# EAGLE design chariotgauge (EAGLE 6.2)
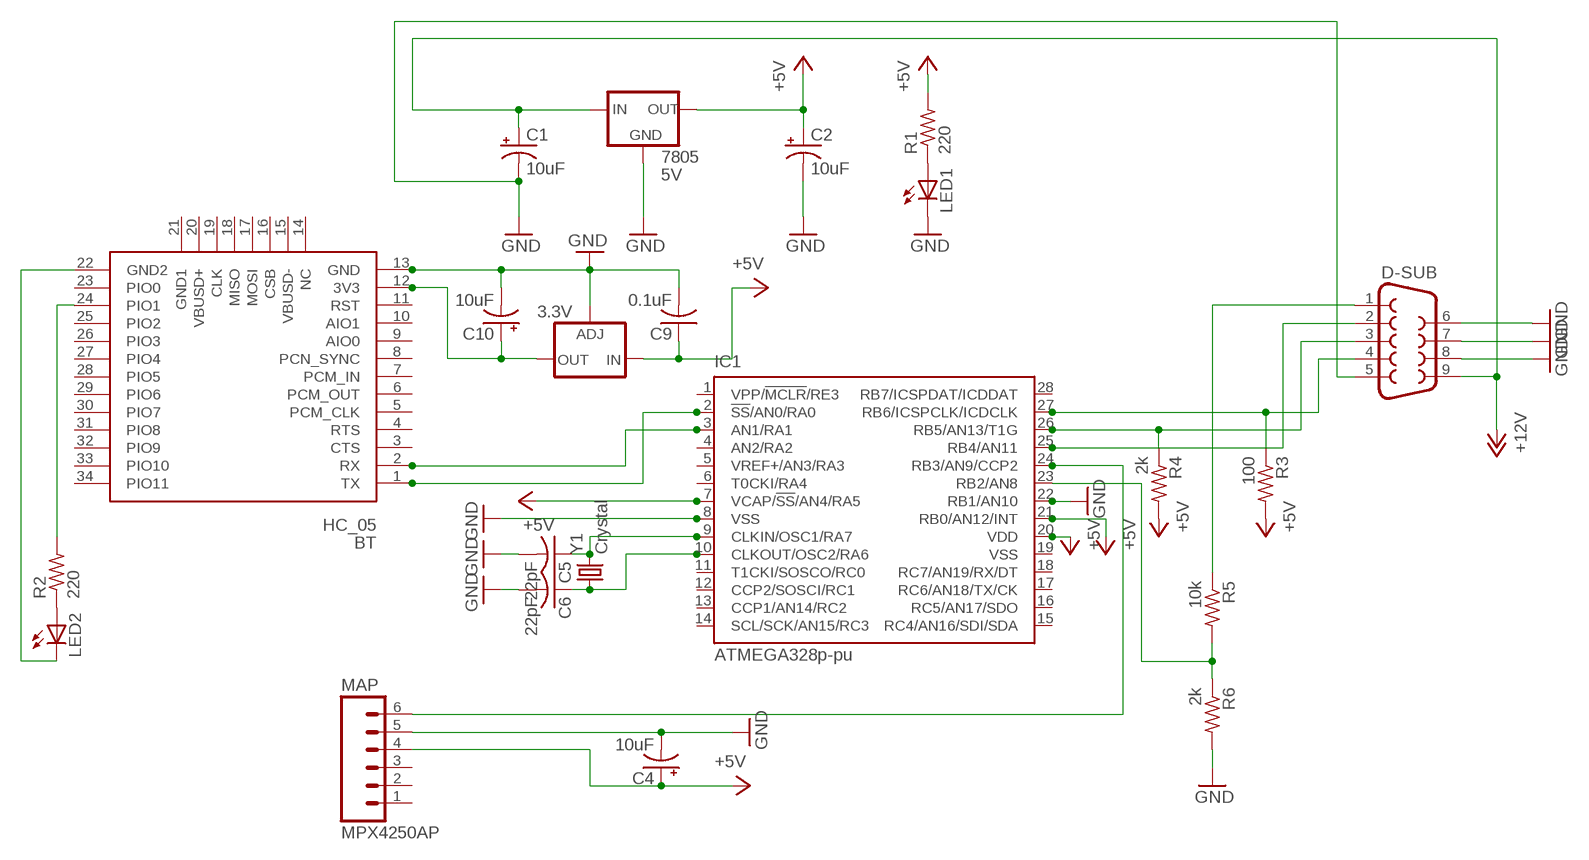
[diagram p0: schematic, sheet 1]

## Parts
3.3V  LM317TL  [317TL]
7805  5V  78XXL  [78XXL]
BT  HC_05  [BLUETOOTH_SMD]
C1  10uF  CAP_POLPTH2  [CPOL-RADIAL-10UF-25V]
C2  10uF  CAP_POLPTH2  [CPOL-RADIAL-10UF-25V]
C4  10uF  CAP_POLPTH2  [CPOL-RADIAL-10UF-25V]
C5  22pF  C-US025-025X050  [C025-025X050]
C6  22pF  C-US025-025X050  [C025-025X050]
C9  0.1uF  C-US025-025X050  [C025-025X050]
C10  10uF  CAP_POLPTH2  [CPOL-RADIAL-10UF-25V]
D-SUB  DB9FEMALE  [DB9]
IC1  ATMEGA328p-pu  PIC16F1516/18P  [DIL28-3]
LED1  LED5MM  [LED5MM]
LED2  LED5MM  [LED5MM]
MAP  MPX4250AP  M06LONGPADS  [1X06_LONGPADS]
R1  220  R-US_0204/7  [0204/7]
R2  220  R-US_0204/7  [0204/7]
R3  100  R-US_0204/7  [0204/7]
R4  2k  R-US_0204/7  [0204/7]
R5  10k  R-US_0204/7  [0204/7]
R6  2k  R-US_0204/7  [0204/7]
Y1  Crystal  CRYSTALHC49US  [HC49US]

## Nets
+5V: 3.3V.3(IN) 7805.OUT C2.1(+) C4.1(+) C9.1 IC1.7(VCAP/!SS!/AN4/RA5) IC1.20(VDD) IC1.21(RB0/AN12/INT) MAP.4 R1.2 R3.2 R4.2
+12V: 7805.IN C1.1(+) D-SUB.9
GND: 3.3V.1(ADJ) 7805.GND BT.13(GND) C1.2(-) C2.2(-) C4.2(-) C5.2 C6.2 C9.2 C10.2(-) D-SUB.5 D-SUB.6 D-SUB.7 D-SUB.8 IC1.8(VSS) IC1.22(RB1/AN10) LED1.K(C) MAP.5 R6.2
N$2: LED1.A R1.1
N$3: IC1.24(RB3/AN9/CCP2) MAP.6
N$4: D-SUB.2 IC1.25(RB4/AN11)
N$5: BT.1(TX) IC1.2(!SS!/AN0/RA0)
N$6: D-SUB.3 IC1.26(RB5/AN13/T1G) R4.1
N$7: BT.24(PIO1) R2.2
N$8: D-SUB.4 IC1.27(RB6/ICSPCLK/ICDCLK) R3.1
N$9: BT.2(RX) IC1.3(AN1/RA1)
N$10: C5.1 IC1.9(CLKIN/OSC1/RA7) Y1.2
N$11: C6.1 IC1.10(CLKOUT/OSC2/RA6) Y1.1
N$13: LED2.A R2.1
N$14: 3.3V.2(OUT) BT.12(3V3) C10.1(+)
N$15: D-SUB.1 R5.1
N$16: BT.22(GND2) LED2.K(C)
N$18: IC1.23(RB2/AN8) R5.2 R6.1
Unconnected: BT.3(CTS) BT.4(RTS) BT.5(PCM_CLK) BT.6(PCM_OUT) BT.7(PCM_IN) BT.8(PCN_SYNC) BT.9(AIO0) BT.10(AIO1) BT.11(RST) BT.14(NC) BT.15(VBUSD-) BT.16(CSB) BT.17(MOSI) BT.18(MISO) BT.19(CLK) BT.20(VBUSD+) BT.21(GND1) BT.23(PIO0) BT.25(PIO2) BT.26(PIO3) BT.27(PIO4) BT.28(PIO5) BT.29(PIO6) BT.30(PIO7) BT.31(PIO8) BT.32(PIO9) BT.33(PIO10) BT.34(PIO11) IC1.1(VPP/!MCLR!/RE3) IC1.4(AN2/RA2) IC1.5(VREF+/AN3/RA3) IC1.6(T0CKI/RA4) IC1.11(T1CKI/SOSCO/RC0) IC1.12(CCP2/SOSCI/RC1) IC1.13(CCP1/AN14/RC2) IC1.14(SCL/SCK/AN15/RC3) IC1.15(RC4/AN16/SDI/SDA) IC1.16(RC5/AN17/SDO) IC1.17(RC6/AN18/TX/CK) IC1.18(RC7/AN19/RX/DT) IC1.28(RB7/ICSPDAT/ICDDAT) MAP.1 MAP.2 MAP.3

## Power pins joined to a net without a drawn wire
VSS: IC1.19(VSS)

## Library data of the parts
3.3V = v-reg:LM317TL: VOLTAGE REGULATOR
7805 = v-reg:78XXL: VOLTAGE REGULATOR
BT = SerialPortBluetooth:HC_05
C1 C2 C4 C10 = SparkFun-Passives:CAP_POL: Capacitor Polarized These are standard SMD and PTH capacitors. Normally 10uF, 47uF, and 100uF in electrolytic and tantalum varieties. Always verify the external diameter of the through hole cap, it varies with capacity, voltage, and manufacturer. The EIA devices should be standard.
C5 C6 C9 = rcl:C-US: CAPACITOR, American symbol
D-SUB = SparkFun-Connectors:DB9: DB9 Connector Standard DB9 (D-Sub 9) serial connector. Can be used for CAN bus as well as RS485 and RS232. Footprint production proven. Spark Fun Electronics SKU : PRT-00429
IC1 = microchip:PIC16*F1516/18: 28/40/44-Pin Flash Microcontrollers with nanoWatt XLP Technology PIC16F1516/1518 AND PIC16LF1516/1518 Source: www.microchip.com PIC16F1516.pdf
LED1 LED2 = led:LED: LED OSRAM: - CHIPLED LG R971, LG N971, LY N971, LG Q971, LY Q971, LO R971, LY R971 LH N974, LH R974 LS Q976, LO Q976, LY Q976 LO Q996 - Hyper CHIPLED LW Q18S LB Q993, LB Q99A, LB R99A - SideLED LS A670, LO A670, LY A670, LG A670, LP A670 LB A673, LV A673, LT A673, LW A673 LH A674 LY A675 LS A676, LA A676, LO A676, LY A676, LW A676 LS A679, LY A679, LG A679 - Hyper Micro SIDELED® LS Y876, LA Y876, LO Y876, LY Y876 LT Y87S - SmartLED LW L88C, LW L88S LB L89C, LB L89S, LG L890 LS L89K, LO L89K, LY L89K LS L896, LA L896, LO L896, LY L896 - TOPLED LS T670, LO T670, LY T670, LG T670, LP T670 LSG T670, LSP T670, LSY T670, LOP T670, LYG T670 LG T671, LOG T671, LSG T671 LB T673, LV T673, LT T673, LW T673 LH T674 LS T676, LA T676, LO T676, LY T676, LB T676, LH T676, LSB T676, LW T676 LB T67C, LV T67C, LT T67C, LS T67K, LO T67K, LY T67K, LW E67C LS E67B, LA E67B, LO E67B, LY E67B, LB E67C, LV E67C, LT E67C LW T67C LS T679, LY T679, LG T679 LS T770, LO T770, LY T770, LG T770, LP T770 LB T773, LV T773, LT T773, LW T773 LH T774 LS E675, LA E675, LY E675, LS T675 LS T776, LA T776, LO T776, LY T776, LB T776 LHGB T686 LT T68C, LB T68C - Hyper Mini TOPLED® LB M676 - Mini TOPLED Santana® LG M470 LS M47K, LO M47K, LY M47K Source: http://www.osram.convergy.de LUXEON: - LUMILED® LXK2-PW12-R00, LXK2-PW12-S00, LXK2-PW14-U00, LXK2-PW14-V00 LXK2-PM12-R00, LXK2-PM12-S00, LXK2-PM14-U00 LXK2-PE12-Q00, LXK2-PE12-R00, LXK2-PE12-S00, LXK2-PE14-T00, LXK2-PE14-U00 LXK2-PB12-K00, LXK2-PB12-L00, LXK2-PB12-M00, LXK2-PB14-N00, LXK2-PB14-P00, LXK2-PB14-Q00 LXK2-PR12-L00, LXK2-PR12-M00, LXK2-PR14-Q00, LXK2-PR14-R00 LXK2-PD12-Q00, LXK2-PD12-R00, LXK2-PD12-S00 LXK2-PH12-R00, LXK2-PH12-S00 LXK2-PL12-P00, LXK2-PL12-Q00, LXK2-PL12-R00 Source: www.luxeon.com KINGBRIGHT: KA-3528ASYC Source: www.kingbright.com
MAP = SparkFun-Connectors:M06: Header 6 Standard 6-pin 0.1" header. Use with straight break away headers (SKU : PRT-00116), right angle break away headers (PRT-00553), swiss pins (PRT-00743), machine pins (PRT-00117), and female headers (PRT-00115). Molex polarized connector foot print use with SKU : PRT-08094 with associated crimp pins and housings. NOTES ON THE VARIANTS LOCK and LOCK_LONGPADS... This footprint was designed to help hold the alignment of a through-hole component (i.e. 6-pin header) while soldering it into place. You may notice that each hole has been shifted either up or down by 0.005 of an inch from it's more standard position (which is a perfectly straight line). This slight alteration caused the pins (the squares in the middle) to touch the edges of the holes. Because they are alternating, it causes a "brace" to hold the component in place. 0.005 has proven to be the perfect amount of "off-center" position when using our standard breakaway headers. Although looks a little odd when you look at the bare footprint, once you have a header in there, the alteration is very hard to notice. Also, if you push a header all the way into place, it is covered up entirely on the bottom side. This idea of altering the position of holes to aid alignment will be further integrated into the Sparkfun Library for other footprints. It can help hold any component with 3 or more connection pins.
R1-R6 = rcl:R-US_: RESISTOR, American symbol
Y1 = SparkFun-FreqCtrl:CRYSTAL: Various standard crystals. Proven footprints. Spark Fun Electronics SKU : COM-00534

## Board
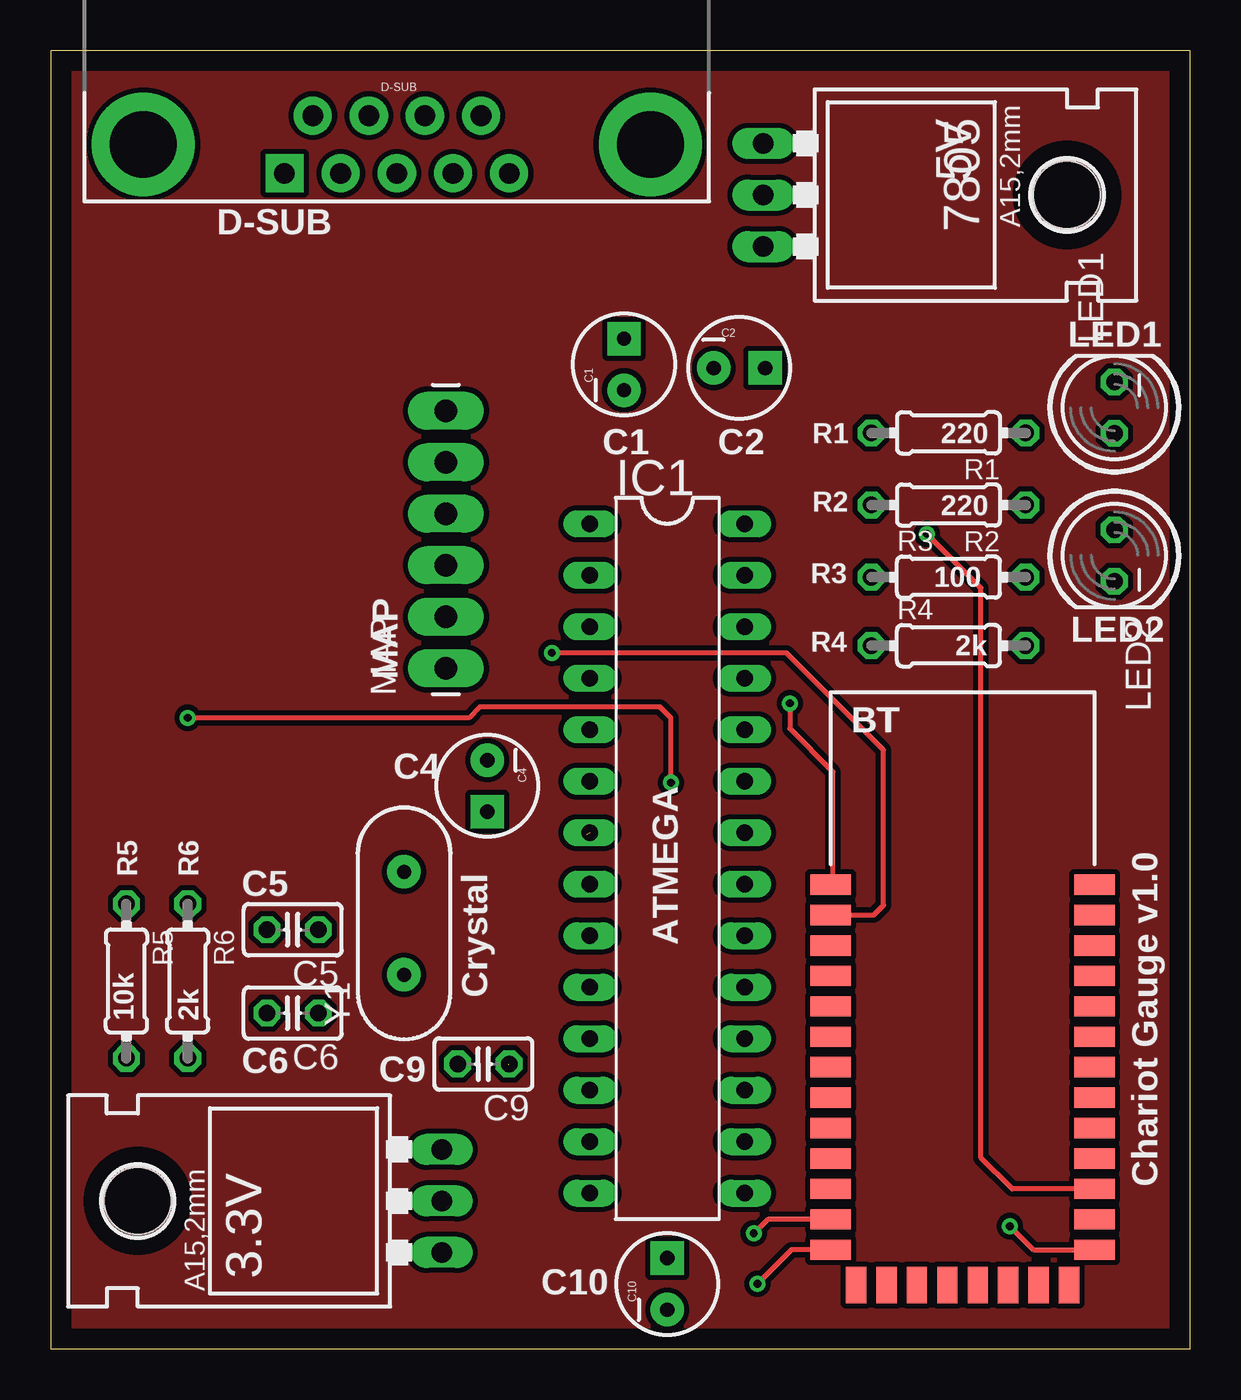
[diagram p1: board, top side]
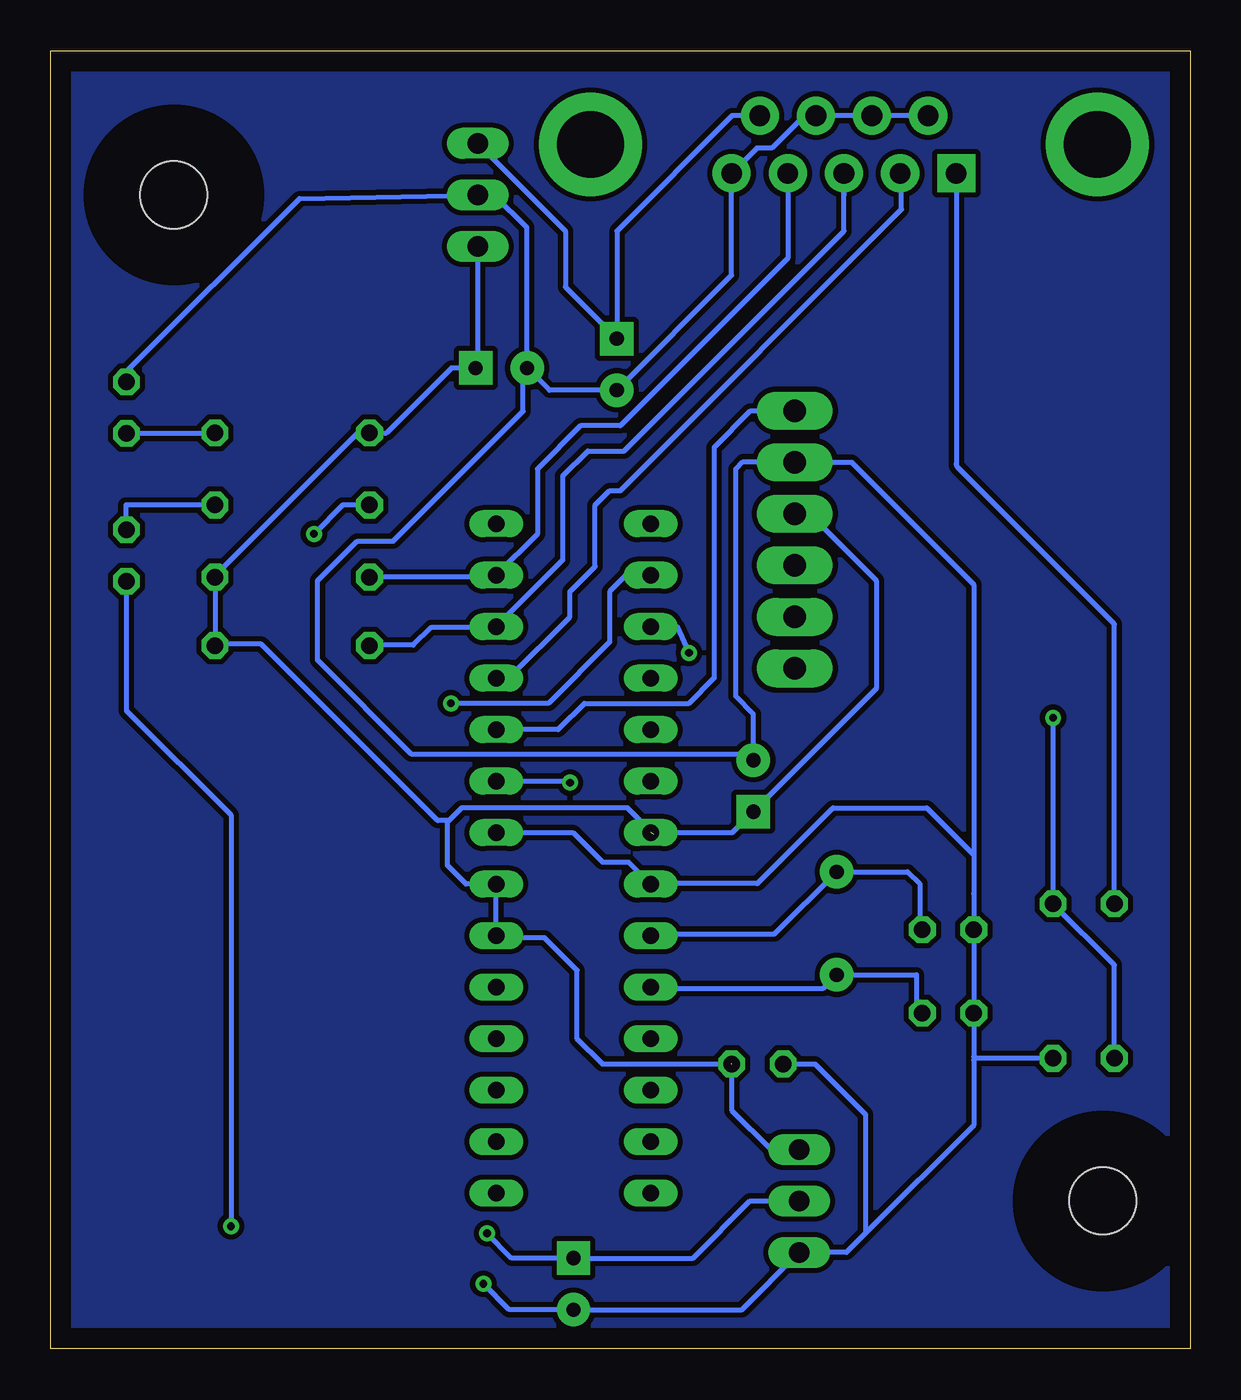
[diagram p2: board, bottom side, seen from below]

Size 56.18 x 64.01 mm. Coordinates in mm from the lower left corner, seen from the top.
Outline: 0,0 56.19,0 56.19,64.01 0,64.01 0,0
Copper layers (1*16): Top 0.035mm / dielectric 1.5mm / Bottom 0.035mm
Design rules: minimum track width 10mil, minimum drill 24mil, track to track 8mil, track to pad 8mil, pad to pad 8mil, via to via 8mil, smd to smd 8mil, copper to edge 40mil, drill to drill 8mil, minimum pad ring 10mil, minimum via ring 8mil, stop-mask expansion 4mil, vias tented up to drill 0mil, thermal gap 10mil

### Footprints (pad centres in the part's own frame; a part is rotated, then mirrored left to right if it is on the bottom)
317TL = drill 1.016 long: 1 -2.54,-3.81; 2 0,-3.81; 3 2.54,-3.81 | hole 3.302: 0,11.176
78XXL = drill 1.016 long: GND 0,-3.81; IN -2.54,-3.81; OUT 2.54,-3.81 | hole 3.302: 0,11.176
BLUETOOTH_SMD = smd 2 x 1: 1 0,0; 2 0,-1.5; 3 0,-3; 4 0,-4.5; 5 0,-6; 6 0,-7.5; 7 0,-9; 8 0,-10.5; 9 0,-12; 10 0,-13.5; 11 0,-15; 12 0,-16.5; 13 0,-18; 22 13,-18; 23 13,-16.5; 24 13,-15; 25 13,-13.5; 26 13,-12; 27 13,-10.5; 28 13,-9; 29 13,-7.5; 30 13,-6; 31 13,-4.5; 32 13,-3; 33 13,-1.5; 34 13,0 | smd 1 x 1.8: 14 1.25,-19.75; 15 2.75,-19.75; 16 4.25,-19.75; 17 5.75,-19.75; 18 7.25,-19.75; 19 8.75,-19.75; 20 10.25,-19.75; 21 11.75,-19.75
CPOL-RADIAL-10UF-25V = drill 0.7 pad 1.651 square: 1 1.27,0 | drill 0.7 pad 1.651: 2 -1.27,0
C025-025X050 = drill 0.813 octagon: 1 -1.27,0; 2 1.27,0
DB9 = drill 1.016 pad 1.88 square: 1 -5.54,-1.42 | drill 1.016 pad 1.88: 2 -2.77,-1.42; 3 0,-1.42; 4 2.77,-1.42; 5 5.54,-1.42; 6 -4.15,1.42; 7 -1.38,1.42; 8 1.38,1.42; 9 4.15,1.42 | drill 3.302 pad 5.08: G1 -12.5,0; G2 12.5,0
DIL28-3 = drill 0.813 long: 1 -16.51,-3.81; 2 -13.97,-3.81; 3 -11.43,-3.81; 4 -8.89,-3.81; 5 -6.35,-3.81; 6 -3.81,-3.81; 7 -1.27,-3.81; 8 1.27,-3.81; 9 3.81,-3.81; 10 6.35,-3.81; 11 8.89,-3.81; 12 11.43,-3.81; 13 13.97,-3.81; 14 16.51,-3.81; 15 16.51,3.81; 16 13.97,3.81; 17 11.43,3.81; 18 8.89,3.81; 19 6.35,3.81; 20 3.81,3.81; 21 1.27,3.81; 22 -1.27,3.81; 23 -3.81,3.81; 24 -6.35,3.81; 25 -8.89,3.81; 26 -11.43,3.81; 27 -13.97,3.81; 28 -16.51,3.81
LED5MM = drill 0.813 octagon: A -1.27,0; K 1.27,0
1X06_LONGPADS = drill 1.118 pad 1.88 long: 1 0,0; 2 2.54,0; 3 5.08,0; 4 7.62,0; 5 10.16,0; 6 12.7,0
0204/7 = drill 0.813 octagon: 1 -3.81,0; 2 3.81,0
HC49US = drill 0.7 pad 1.651: 1 -2.54,0; 2 2.54,0

### Placement (x,y rotation side)
3.3V  15.47,7.29 90 top
7805  38.94,56.9 270 top
BT  38.46,22.88 0 top
C1  28.27,48.54 90 top
C2  33.96,48.36 0 top
C4  21.53,27.75 270 top
C5  11.93,20.67 180 top
C6  11.93,16.55 180 top
C9  21.34,14.05 180 top
C10  30.4,3.2 90 top
D-SUB  17.07,59.39 0 top
IC1  30.4,24.18 270 top
LED1  52.45,46.41 90 top
LED2  52.45,39.12 270 top
MAP  19.49,33.55 90 top
R1  44.27,45.16 180 top
R2  44.27,41.61 180 top
R3  44.27,38.05 0 top
R4  44.27,34.67 0 top
R5  3.73,18.14 270 top
R6  6.76,18.14 270 top
Y1  17.42,20.98 90 top

### Tracks (layer width: path | path; a pad name or v marks a point on that pad's centre or on a via)
+5V  (2 unrouted)
  Bottom 0.254: 26.43,25.36 27.74,26.67 35.92,26.67 36.54,26.05 | 36.54,26.05 36.63,25.96 36.63,23.82 35.71,22.91 IC1.21 IC1.20 34.11,20.27 31.83,20.27 30.23,18.67 30.23,15.29 28.98,14.05 C9.1 | 36.54,26.05 37.1,26.05 45.8,34.75 48.12,34.75 R4.2 R3.2 48.18,38.03 41.05,45.16 R1.2 39.62,45.16 36.42,48.36 C2.1 35.13,48.46 7805.OUT | 3.3V.3 20.68,9.83 22.58,11.73 22.58,14.02 | IC1.7 22.57,25.45 C4.1 15.47,32.55 15.47,37.87 18.77,41.17 MAP.4
+12V
  Bottom 0.254: D-SUB.9 22.58,60.8 28.27,55.12 C1.1 30.81,52.35 30.81,55.12 7805.IN
GND  (via drill 0.38)
  Top 0.254: BT.13 36.53,4.88 v34.85,3.2
  Bottom 0.152: 10.64,14.25 10.66,14.22
  Bottom 0.254: 26.64,22.91 IC1.8 | IC1.22 30.43,25.45 28.98,24 27.69,24 IC1.8 | IC1.8 26.57,22.94 21.34,22.94 17.6,26.67 12.98,26.67 10.67,24.36 | D-SUB.6 D-SUB.7 D-SUB.8 19.03,60.8 20.62,59.21 21.37,59.21 D-SUB.5 22.61,52.93 C1.2 31.6,47.27 C2.2 | 52.48,47.65 LED1.K 52.45,48.18 43.92,56.72 7805.GND 34.31,56.9 32.72,55.3 32.72,48.39 C2.2 | 10.67,24.36 10.67,22.45 C5.2 C6.2 10.66,14.4 | 10.66,14.4 10.66,14.22 10.66,11.03 16,5.69 | C2.2 32.89,48.16 32.89,46.23 39.29,39.83 41.07,39.83 43.03,37.87 43.03,33.96 38.41,29.34 21.85,29.34 C4.2 21.53,31.31 22.4,32.18 22.4,43.38 22.05,43.74 19.51,43.74 MAP.5 16.69,43.72 10.67,37.69 10.67,24.36 | v34.85,3.2 33.58,1.93 C10.2 22.1,1.93 3.3V.1 16.94,4.75 16,5.69 | 16,5.69 16,11.56 18.49,14.05 C9.2 | 10.66,14.4 10.66,14.4 arc-45 10.48,14.33 R6.2
N$1
  pour Bottom (isolate 0.254): 0,64.01 56.18,64.01 56.18,0 0,0
N$2
  Bottom 0.254: R1.1 48.25,45.12 LED1.A
N$3
  Bottom 0.254: IC1.24 31.17,30.53 29.87,31.83 24.71,31.83 23.47,33.07 23.47,44.45 21.69,46.23 19.52,46.23 MAP.6
N$4
  Bottom 0.254: 14.4,57.97 D-SUB.2 14.22,57.89 14.22,56.19 28.09,42.32 28.63,42.32 29.34,41.6 29.34,38.58 30.58,37.34 30.58,36.09 33.6,33.07 IC1.25
N$5  (via drill 0.38)
  Top 0.254: BT.1 38.58,23 38.58,28.45 36.45,30.58 v36.45,31.83
  Bottom 0.254: IC1.2 27.81,38.15 28.63,37.34 28.63,34.85 31.65,31.83 v36.45,31.83
N$6
  Bottom 0.254: R4.1 40.45,34.7 38.3,34.7 37.44,35.56 34.26,35.56 IC1.26 30.94,38.89 30.94,43.03 29.69,44.27 27.91,44.27 17.07,55.12 D-SUB.3 17.07,56.9
N$7  (via drill 0.38)
  Top 0.254: BT.24 47.41,7.88 45.87,9.42 45.87,37.52 v43.2,40.18
  Bottom 0.254: R2.2 41.78,41.6 v43.2,40.18
N$8
  Bottom 0.254: R3.1 34.31,38.05 IC1.27 32.18,40.18 32.18,43.38 30.05,45.52 28.09,45.52 19.84,53.77 D-SUB.4
N$9  (via drill 0.38)
  Top 0.254: BT.2 40.59,21.39 41.07,21.87 41.07,29.52 36.27,34.31 v24.71,34.31
  Bottom 0.254: IC1.3 25.3,35.61 v24.71,34.31
N$10
  Bottom 0.254: IC1.9 26.52,20.45 20.5,20.45 Y1.2 13.92,23.52 13.34,22.94 13.34,20.8 C5.1
N$11
  Bottom 0.254: IC1.10 26.54,17.78 18.09,17.78 Y1.1 13.49,18.44 13.49,16.84 C6.1
N$12
  pour Top (isolate 0.254): 0,64.01 56.18,64.01 56.18,0 0,0
N$13
  Bottom 0.254: R2.1 52.48,41.6 LED2.A
N$14  (via drill 0.38)
  Top 0.254: BT.12 35.37,6.38 v34.67,5.69
  Bottom 0.254: 3.3V.2 21.69,7.29 24.51,4.47 C10.1 33.45,4.47 v34.67,5.69
N$15
  Bottom 0.254: D-SUB.1 11.53,43.64 arc-45 11.45,43.46 3.73,35.74 R5.1
N$16  (via drill 0.38)
  Top 0.254: v47.3,6.04 48.45,4.88 BT.22
  Bottom 0.254: LED2.K 52.45,31.47 47.3,26.31 v47.3,6.04
N$18  (via drill 0.38)
  Top 0.254: v30.58,27.91 30.58,31.11 30.05,31.65 21.16,31.65 20.62,31.11 v6.76,31.11
  Bottom 0.254: R5.2 3.73,18.92 R6.1 v6.76,31.11 | IC1.23 30.66,27.99 v30.58,27.91

### Text on the board
_tplace: 5V | D-SUB | LED1 | R1 | 220 | C1 | C2 | R2 | 220 | R3 | 100 | LED2 | R4 | 2k | MAP | BT | C4 | C5 | R5 | R6 | ATMEGA | Crystal | 10k | 2k | C6 | C9 | Chariot Gauge v1.0 | 3.3V | C10